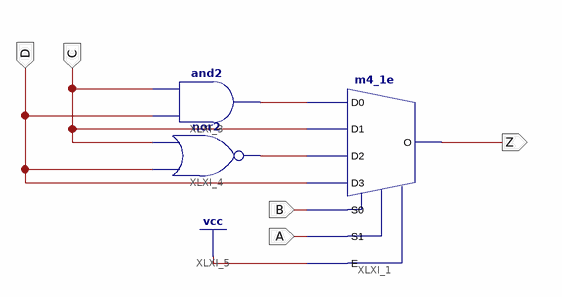
[diagram p0: schematic sheet 1]
// Xilinx ISE schematic p2ej1a.sch (spartan3) as structural Verilog: 3 symbols, 5 ports
module p2ej1a (
  input  A,
  input  B,
  input  D,
  input  C,
  output Z
);

  wire XLXN_30, XLXN_35;

  m4_1e XLXI_1 (.D0(XLXN_30), .D1(C), .D2(XLXN_35), .D3(D), .E(1'b1), .S0(B), .S1(A), .O(Z));
  and XLXI_3 (XLXN_30, D, C);
  nor XLXI_4 (XLXN_35, D, C);
endmodule
